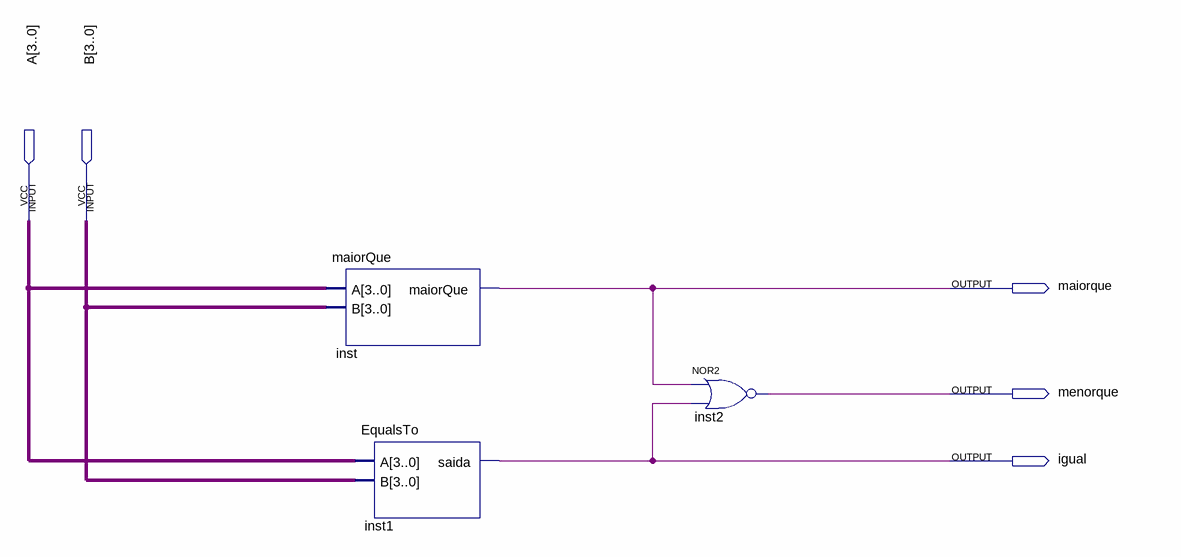
[diagram p0: schematic sheet]
// Quartus schematic maior_menor_igual.bdf as structural Verilog: 3 symbols, 5 pins
module maior_menor_igual (
  input  [3:0] A,
  input  [3:0] B,
  output maiorque,
  output menorque,
  output igual
);

  maiorQue inst (.A(A), .B(B), .maiorQue(maiorque));
  EqualsTo inst1 (.A(A), .B(B), .saida(igual));
  nor inst2 (menorque, maiorque, igual);
endmodule
